# Altium schematic sheet 06) ANALOG TRANSLATION.SchDoc
size 701 x 447 mm
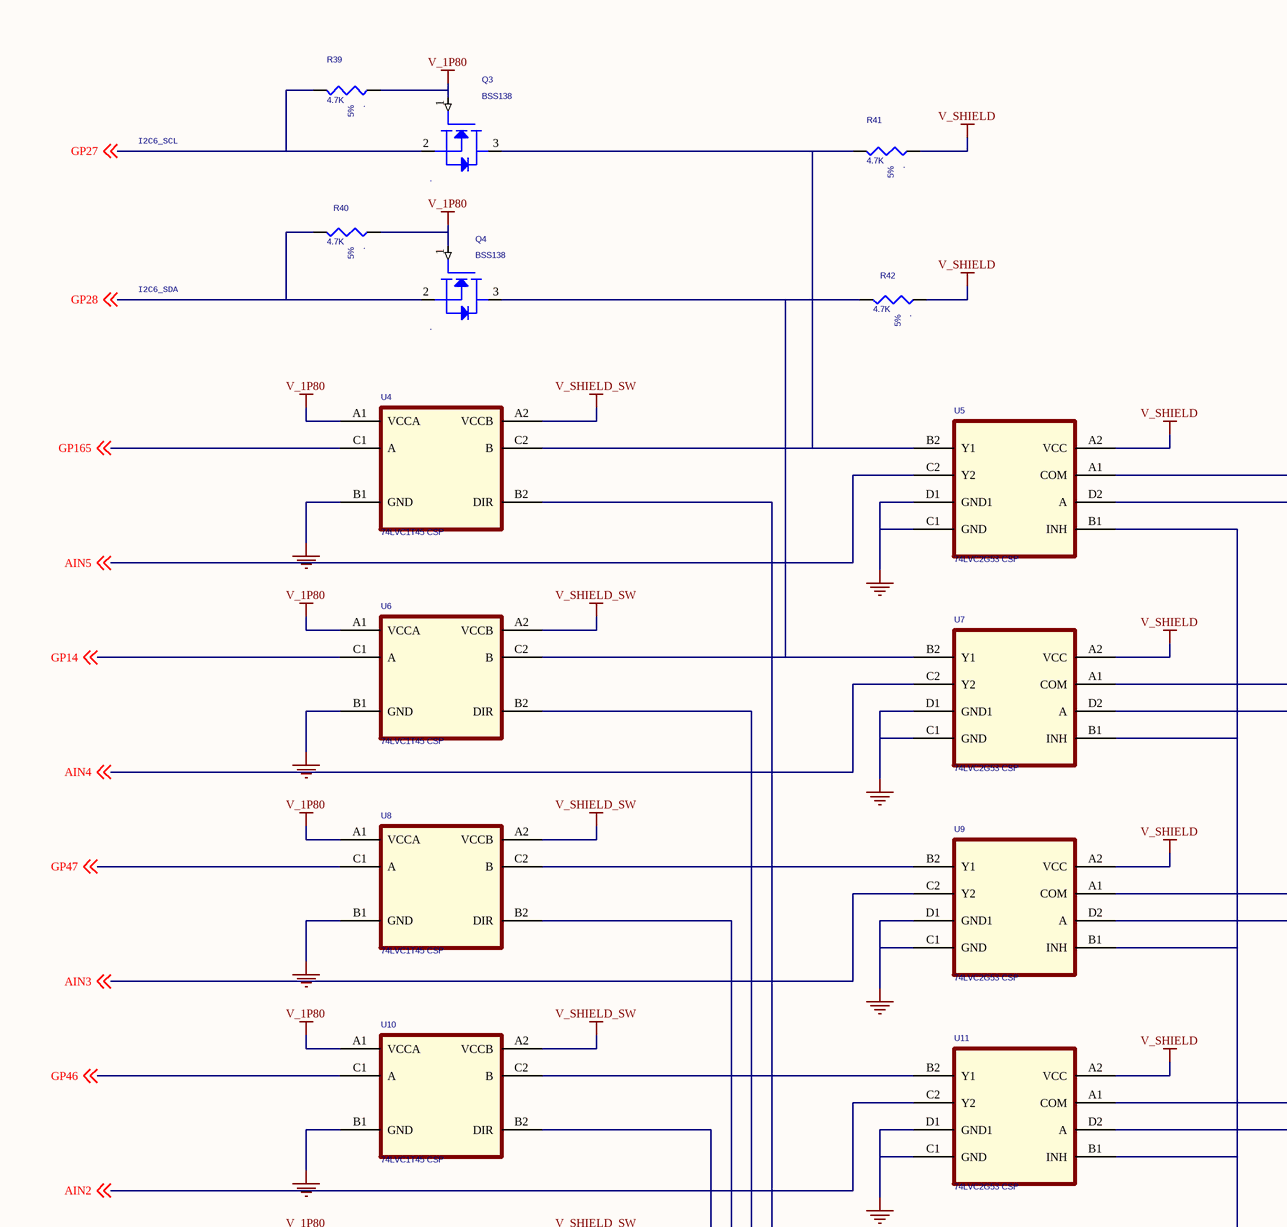
[diagram p0: 06) ANALOG TRANSLATION.SchDoc, top left]
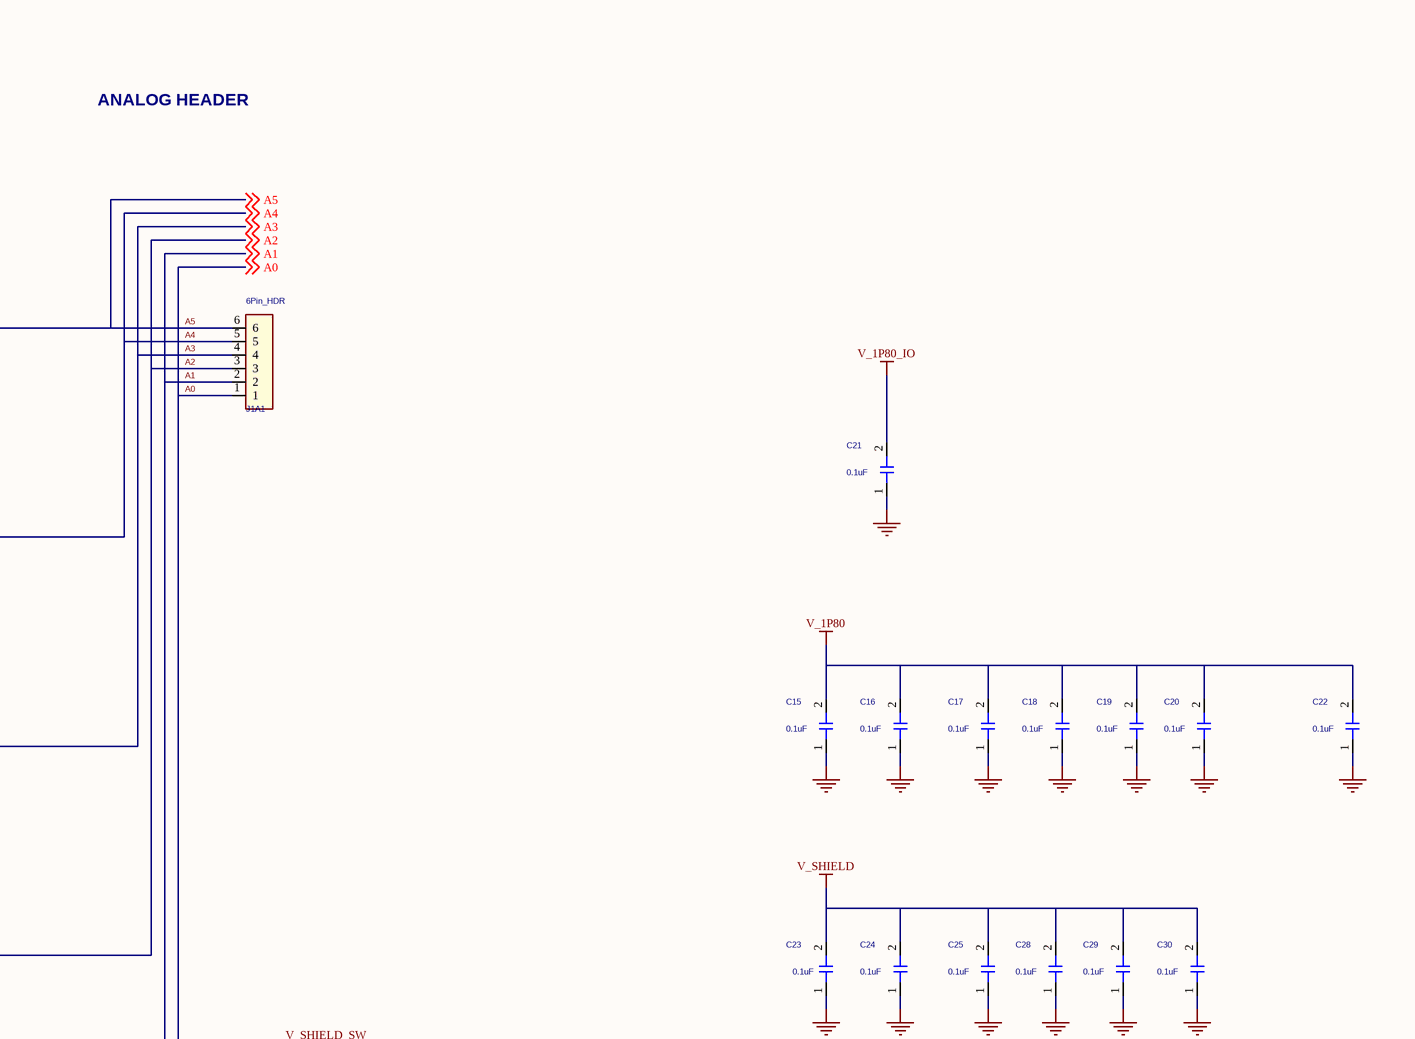
[diagram p1: 06) ANALOG TRANSLATION.SchDoc, top right]
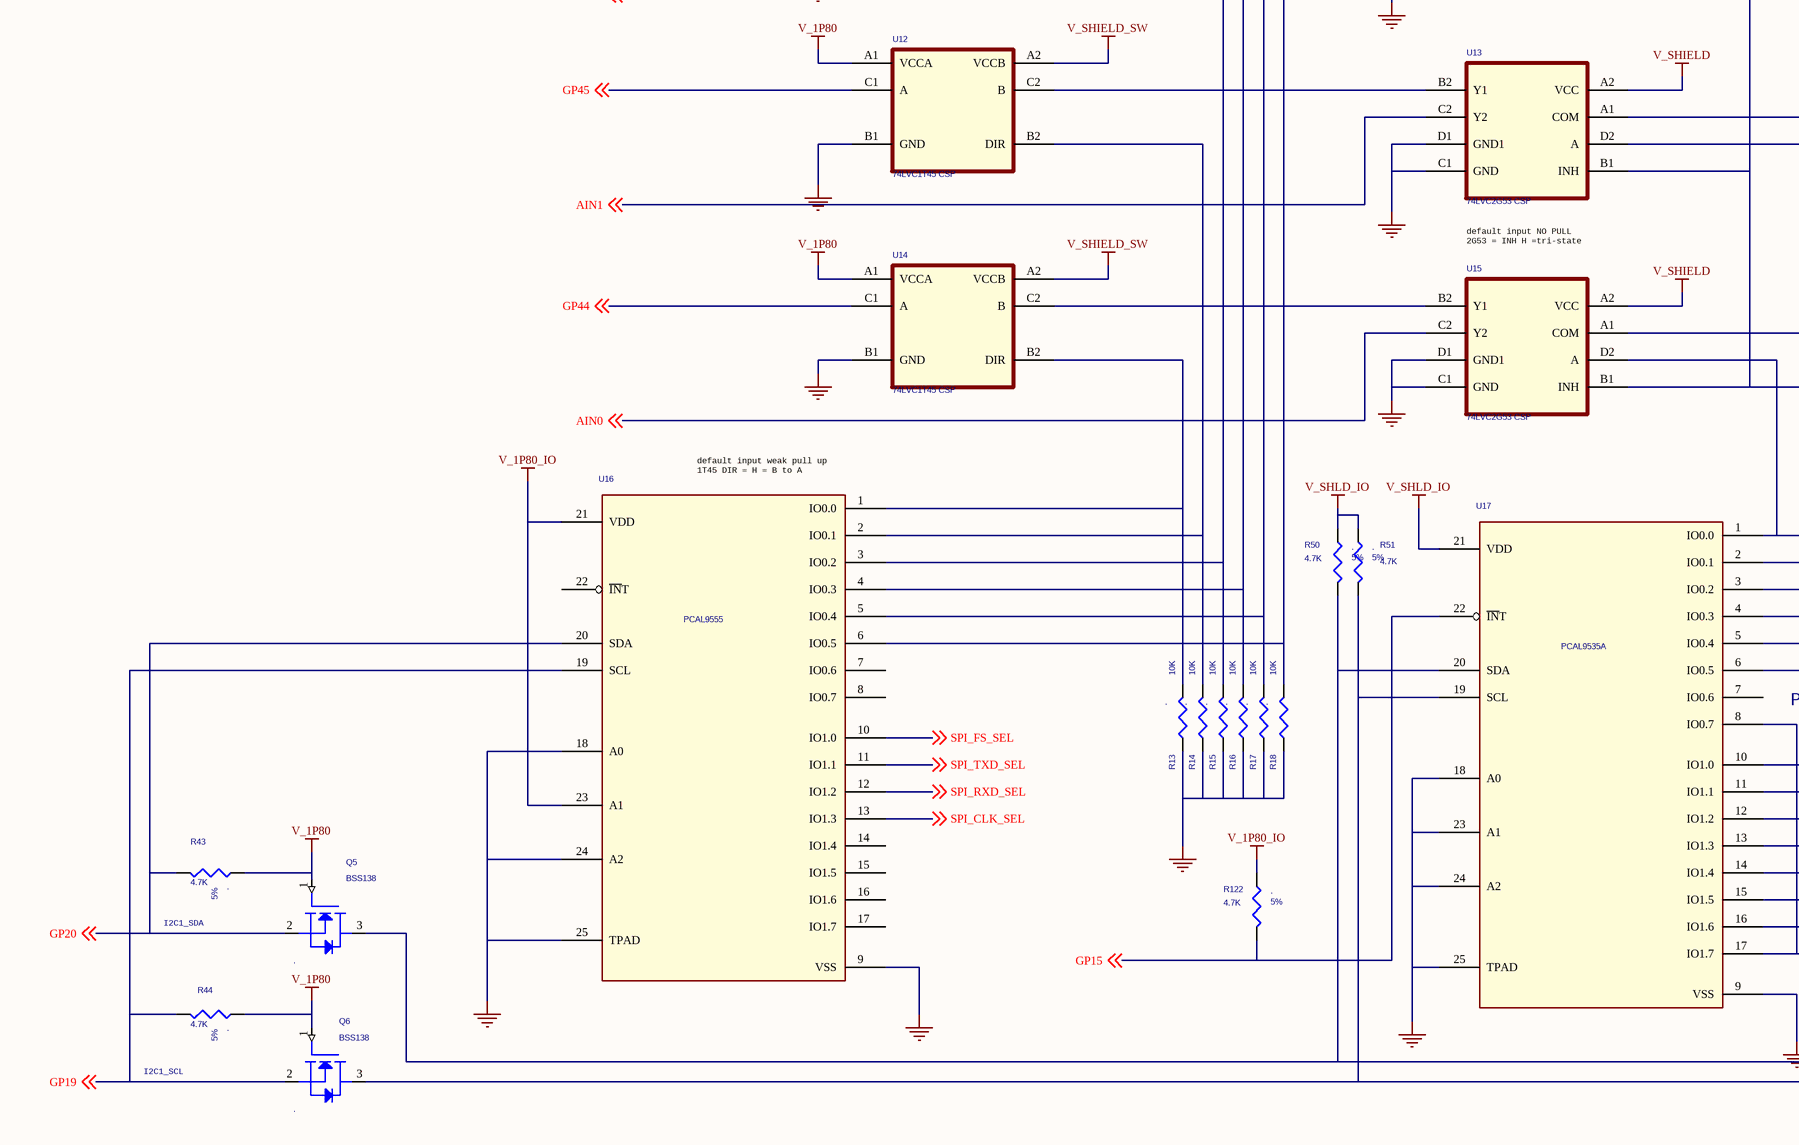
[diagram p2: 06) ANALOG TRANSLATION.SchDoc, bottom left]
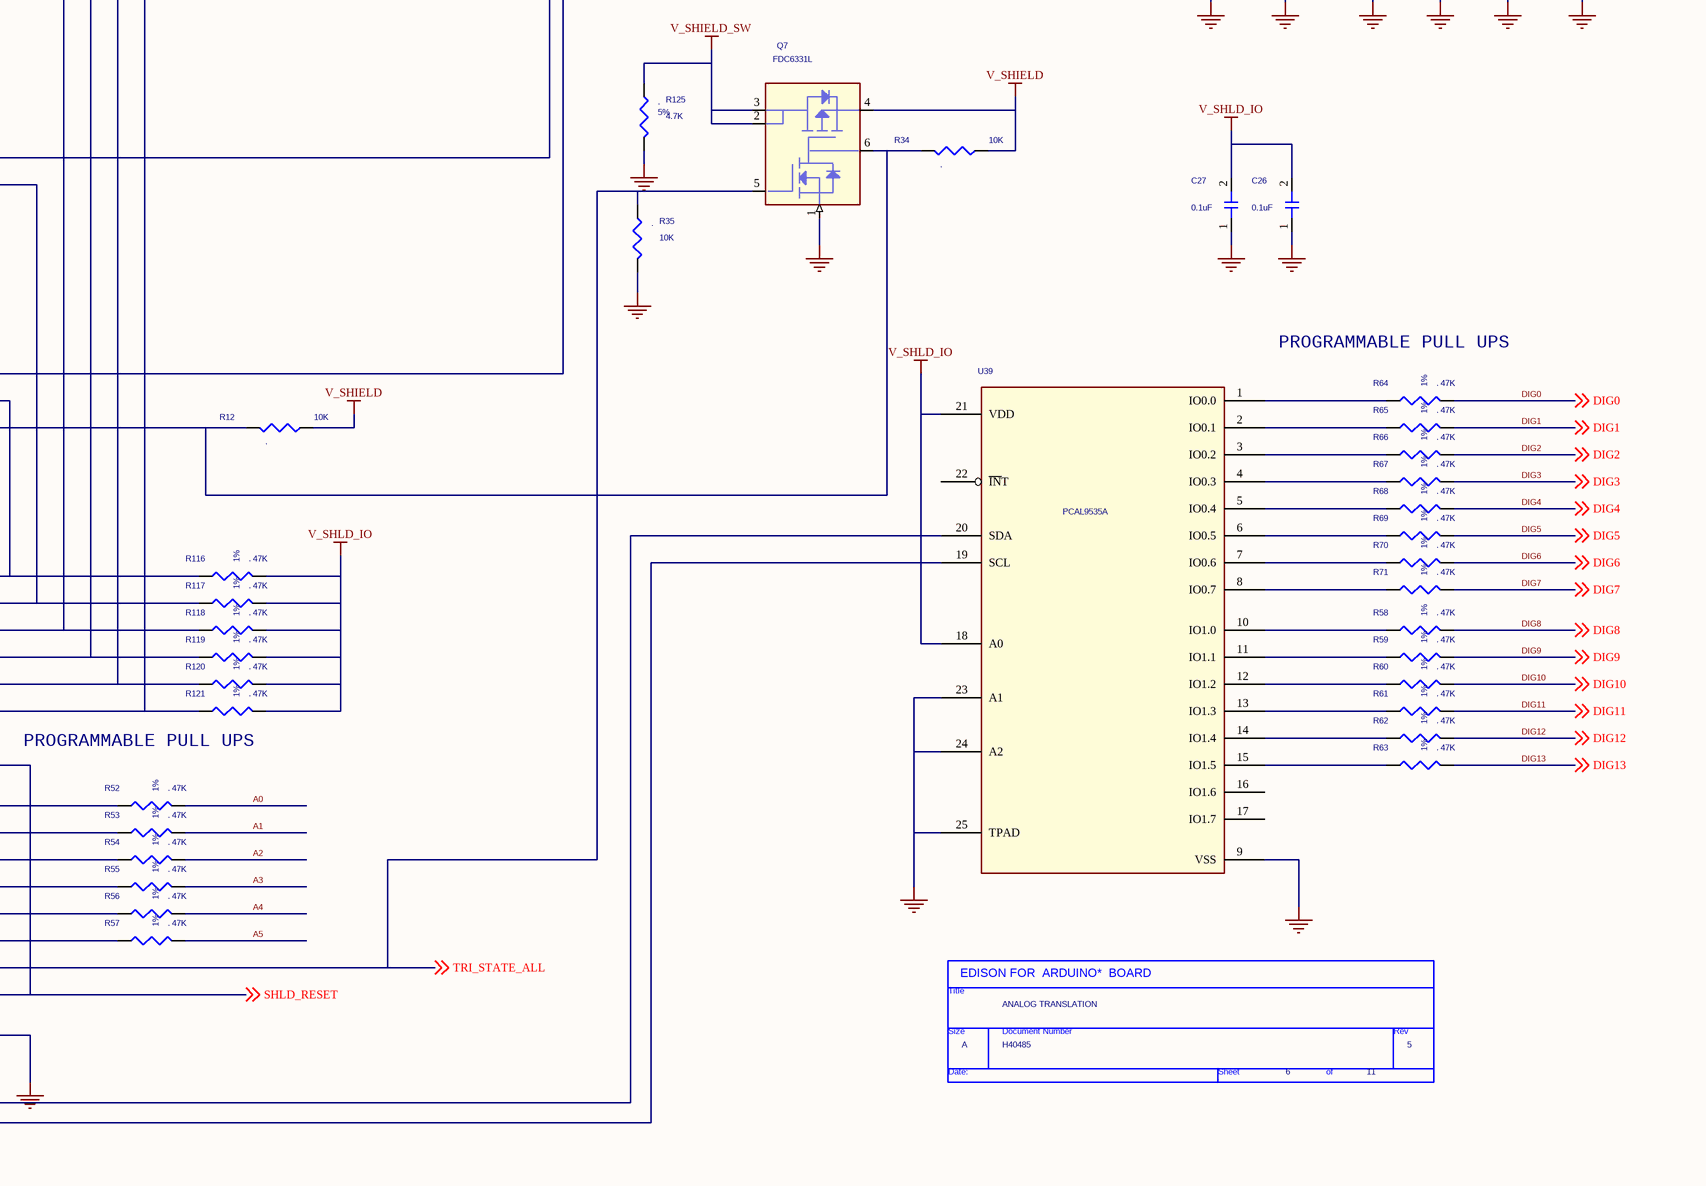
[diagram p3: 06) ANALOG TRANSLATION.SchDoc, bottom right]

## Parts
*  Page Count: 11  Page Number: 6  Page Size: A  Title: ANALOG TRANSLATION  RevCode: 5  Doc: H40485  (hidden comment: TitleBlock0)  (graphical)
C15  0.1uF  [C0201]
C16  0.1uF  [C0201]
C17  0.1uF  [C0201]
C18  0.1uF  [C0201]
C19  0.1uF  [C0201]
C20  0.1uF  [C0201]
C21  0.1uF  [C0201]
C22  0.1uF  [C0201]
C23  0.1uF  [C0201]
C24  0.1uF  [C0201]
C25  0.1uF  [C0201]
C26  0.1uF  [C0201]
C27  0.1uF  [C0201]
C28  0.1uF  [C0201]
C29  0.1uF  [C0201]
C30  0.1uF  [C0201]
J1A1  6Pin_HDR  [109728-038]
Q3  BSS138  NO_STUFF: .  [SOT23]
Q4  BSS138  NO_STUFF: .  [SOT23]
Q5  BSS138  NO_STUFF: .  [SOT23]
Q6  BSS138  NO_STUFF: .  [SOT23]
Q7  FDC6331L  [SSOT-6]
R12  10K  NO_STUFF: .  [SMR0201]
R13  10K  NO_STUFF: .  [SMR0201]
R14  10K  NO_STUFF: .  [SMR0201]
R15  10K  NO_STUFF: .  [SMR0201]
R16  10K  NO_STUFF: .  [SMR0201]
R17  10K  NO_STUFF: .  [SMR0201]
R18  10K  NO_STUFF: .  [SMR0201]
R34  10K  NO_STUFF: .  [SMR0201]
R35  10K  NO_STUFF: .  [SMR0201]
R39  4.7K  NO_STUFF: .  TOL: 5%  [SMR0201]
R40  4.7K  NO_STUFF: .  TOL: 5%  [SMR0201]
R41  4.7K  NO_STUFF: .  TOL: 5%  [SMR0201]
R42  4.7K  NO_STUFF: .  TOL: 5%  [SMR0201]
R43  4.7K  NO_STUFF: .  TOL: 5%  [SMR0201]
R44  4.7K  NO_STUFF: .  TOL: 5%  [SMR0201]
R50  4.7K  NO_STUFF: .  TOL: 5%  [SMR0201]
R51  4.7K  NO_STUFF: .  TOL: 5%  [SMR0201]
R52  47K  TOL: 1%  NO_STUFF: .  [SMR0201]
R53  47K  TOL: 1%  NO_STUFF: .  [SMR0201]
R54  47K  TOL: 1%  NO_STUFF: .  [SMR0201]
R55  47K  TOL: 1%  NO_STUFF: .  [SMR0201]
R56  47K  TOL: 1%  NO_STUFF: .  [SMR0201]
R57  47K  TOL: 1%  NO_STUFF: .  [SMR0201]
R58  47K  TOL: 1%  NO_STUFF: .  [SMR0201]
R59  47K  TOL: 1%  NO_STUFF: .  [SMR0201]
R60  47K  TOL: 1%  NO_STUFF: .  [SMR0201]
R61  47K  TOL: 1%  NO_STUFF: .  [SMR0201]
R62  47K  TOL: 1%  NO_STUFF: .  [SMR0201]
R63  47K  TOL: 1%  NO_STUFF: .  [SMR0201]
R64  47K  TOL: 1%  NO_STUFF: .  [SMR0201]
R65  47K  TOL: 1%  NO_STUFF: .  [SMR0201]
R66  47K  TOL: 1%  NO_STUFF: .  [SMR0201]
R67  47K  TOL: 1%  NO_STUFF: .  [SMR0201]
R68  47K  TOL: 1%  NO_STUFF: .  [SMR0201]
R69  47K  TOL: 1%  NO_STUFF: .  [SMR0201]
R70  47K  TOL: 1%  NO_STUFF: .  [SMR0201]
R71  47K  TOL: 1%  NO_STUFF: .  [SMR0201]
R116  47K  TOL: 1%  NO_STUFF: .  [SMR0201]
R117  47K  TOL: 1%  NO_STUFF: .  [SMR0201]
R118  47K  TOL: 1%  NO_STUFF: .  [SMR0201]
R119  47K  TOL: 1%  NO_STUFF: .  [SMR0201]
R120  47K  TOL: 1%  NO_STUFF: .  [SMR0201]
R121  47K  TOL: 1%  NO_STUFF: .  [SMR0201]
R122  4.7K  NO_STUFF: .  TOL: 5%  [SMR0201]
R125  4.7K  NO_STUFF: .  TOL: 5%  [SMR0201]
U4  74LVC1T45 CSP  [bga6_5mm_37x57]
U5  74LVC2G53 CSP  [bga8_2X4_P5MM]
U6  74LVC1T45 CSP  [bga6_5mm_37x57]
U7  74LVC2G53 CSP  [bga8_2X4_P5MM]
U8  74LVC1T45 CSP  [bga6_5mm_37x57]
U9  74LVC2G53 CSP  [bga8_2X4_P5MM]
U10  74LVC1T45 CSP  [bga6_5mm_37x57]
U11  74LVC2G53 CSP  [bga8_2X4_P5MM]
U12  74LVC1T45 CSP  [bga6_5mm_37x57]
U13  74LVC2G53 CSP  [bga8_2X4_P5MM]
U14  74LVC1T45 CSP  [bga6_5mm_37x57]
U15  74LVC2G53 CSP  [bga8_2X4_P5MM]
U16  PCAL9555  [LCC25_S41_5DF89X89MA]
U17  PCAL9535A  [LCC25_S41_5DF89X89MA]
U39  PCAL9535A  [LCC25_S41_5DF89X89MA]

## Nets
GND: C15.1(END1) C16.1(END1) C17.1(END1) C18.1(END1) C19.1(END1) C20.1(END1) C21.1(END1) C22.1(END1) C23.1(END1) C24.1(END1) C25.1(END1) C26.1(END1) C27.1(END1) C28.1(END1) C29.1(END1) C30.1(END1) Q7.1(R2) R13.1 R14.1 R15.1 R16.1 R17.1 R18.1 R35.1 R125.1 U4.B1(GND) U5.C1(GND) U5.D1(GND1) U6.B1(GND) U7.C1(GND) U7.D1(GND1) U8.B1(GND) U9.C1(GND) U9.D1(GND1) U10.B1(GND) U11.C1(GND) U11.D1(GND1) U12.B1(GND) U13.C1(GND) U13.D1(GND1) U14.B1(GND) U15.C1(GND) U15.D1(GND1) U16.9(VSS) U16.18(A0) U16.24(A2) U16.25(TPAD) U17.9(VSS) U17.18(A0) U17.23(A1) U17.24(A2) U17.25(TPAD) U39.9(VSS) U39.23(A1) U39.24(A2) U39.25(TPAD)
V_1P80: C15.2(END2) C16.2(END2) C17.2(END2) C18.2(END2) C19.2(END2) C20.2(END2) C22.2(END2) Q3.1(G) Q4.1(G) Q5.1(G) Q6.1(G) R39.2 R40.2 R43.2 R44.2 U4.A1(VCCA) U6.A1(VCCA) U8.A1(VCCA) U10.A1(VCCA) U12.A1(VCCA) U14.A1(VCCA)
V_1P80_IO: C21.2(END2) R122.2 U16.21(VDD) U16.23(A1)
V_SHIELD: C23.2(END2) C24.2(END2) C25.2(END2) C28.2(END2) C29.2(END2) C30.2(END2) Q7.4(VOUT) R12.1 R34.1 R41.2 R42.2 U5.A2(VCC) U7.A2(VCC) U9.A2(VCC) U11.A2(VCC) U13.A2(VCC) U15.A2(VCC)
V_SHIELD_SW: Q7.2(VOUT2) Q7.3(VOUT1) R125.2 U4.A2(VCCB) U6.A2(VCCB) U8.A2(VCCB) U10.A2(VCCB) U12.A2(VCCB) U14.A2(VCCB)
V_SHLD_IO: C26.2(END2) C27.2(END2) R50.2 R51.2 R116.2 R117.2 R118.2 R119.2 R120.2 R121.2 U17.21(VDD) U39.18(A0) U39.21(VDD)
A0: J1A1.1 R52.2 U15.A1(COM) ; off-sheet A0
A1: J1A1.2 R53.2 U13.A1(COM) ; off-sheet A1
A2: J1A1.3 R54.2 U11.A1(COM) ; off-sheet A2
A3: J1A1.4 R55.2 U9.A1(COM) ; off-sheet A3
A4: J1A1.5 R56.2 U7.A1(COM) ; off-sheet A4
A5: J1A1.6 R57.2 U5.A1(COM) ; off-sheet A5
AIN0: U15.C2(Y2) ; off-sheet AIN0
AIN1: U13.C2(Y2) ; off-sheet AIN1
AIN2: U11.C2(Y2) ; off-sheet AIN2
AIN3: U9.C2(Y2) ; off-sheet AIN3
AIN4: U7.C2(Y2) ; off-sheet AIN4
AIN5: U5.C2(Y2) ; off-sheet AIN5
DIG0: R64.2 ; off-sheet DIG0
DIG1: R65.2 ; off-sheet DIG1
DIG2: R66.2 ; off-sheet DIG2
DIG3: R67.2 ; off-sheet DIG3
DIG4: R68.2 ; off-sheet DIG4
DIG5: R69.2 ; off-sheet DIG5
DIG6: R70.2 ; off-sheet DIG6
DIG7: R71.2 ; off-sheet DIG7
DIG8: R58.2 ; off-sheet DIG8
DIG9: R59.2 ; off-sheet DIG9
DIG10: R60.2 ; off-sheet DIG10
DIG11: R61.2 ; off-sheet DIG11
DIG12: R62.2 ; off-sheet DIG12
DIG13: R63.2 ; off-sheet DIG13
GP14: U6.C1(A) ; off-sheet GP14
GP15: R122.1 U17.22(~{IN}T) ; off-sheet GP15
GP19: Q6.2(S) R44.1 U16.19(SCL) ; off-sheet GP19
GP20: Q5.2(S) R43.1 U16.20(SDA) ; off-sheet GP20
GP27: Q3.2(S) R39.1 ; off-sheet GP27
GP28: Q4.2(S) R40.1 ; off-sheet GP28
GP44: U14.C1(A) ; off-sheet GP44
GP45: U12.C1(A) ; off-sheet GP45
GP46: U10.C1(A) ; off-sheet GP46
GP47: U8.C1(A) ; off-sheet GP47
GP165: U4.C1(A) ; off-sheet GP165
SHLD_RESET: U17.8(IO0.7) U17.17(IO1.7) ; off-sheet SHLD_RESET
SPI_CLK_SEL: U16.13(IO1.3) ; off-sheet SPI_CLK_SEL
SPI_FS_SEL: U16.10(IO1.0) ; off-sheet SPI_FS_SEL
SPI_RXD_SEL: U16.12(IO1.2) ; off-sheet SPI_RXD_SEL
SPI_TXD_SEL: U16.11(IO1.1) ; off-sheet SPI_TXD_SEL
TRI_STATE_ALL: Q7.5(ON) R35.2 U17.16(IO1.6) ; off-sheet TRI_STATE_ALL
NetQ3_3: Q3.3(D) R41.1 U4.C2(B) U5.B2(Y1)
NetQ4_3: Q4.3(D) R42.1 U6.C2(B) U7.B2(Y1)
NetQ5_3: Q5.3(D) R50.1 U17.20(SDA) U39.20(SDA)
NetQ6_3: Q6.3(D) R51.1 U17.19(SCL) U39.19(SCL)
NetQ7_6: Q7.6(R1C1) R12.2 R34.2 U5.B1(INH) U7.B1(INH) U9.B1(INH) U11.B1(INH) U13.B1(INH) U15.B1(INH)
NetR13_2: R13.2 U14.B2(DIR) U16.1(IO0.0)
NetR14_2: R14.2 U12.B2(DIR) U16.2(IO0.1)
NetR15_2: R15.2 U10.B2(DIR) U16.3(IO0.2)
NetR16_2: R16.2 U8.B2(DIR) U16.4(IO0.3)
NetR17_2: R17.2 U6.B2(DIR) U16.5(IO0.4)
NetR18_2: R18.2 U4.B2(DIR) U16.6(IO0.5)
NetR52_1: R52.1 U17.10(IO1.0)
NetR53_1: R53.1 U17.11(IO1.1)
NetR54_1: R54.1 U17.12(IO1.2)
NetR55_1: R55.1 U17.13(IO1.3)
NetR56_1: R56.1 U17.14(IO1.4)
NetR57_1: R57.1 U17.15(IO1.5)
NetR58_1: R58.1 U39.10(IO1.0)
NetR59_1: R59.1 U39.11(IO1.1)
NetR60_1: R60.1 U39.12(IO1.2)
NetR61_1: R61.1 U39.13(IO1.3)
NetR62_1: R62.1 U39.14(IO1.4)
NetR63_1: R63.1 U39.15(IO1.5)
NetR64_1: R64.1 U39.1(IO0.0)
NetR65_1: R65.1 U39.2(IO0.1)
NetR66_1: R66.1 U39.3(IO0.2)
NetR67_1: R67.1 U39.4(IO0.3)
NetR68_1: R68.1 U39.5(IO0.4)
NetR69_1: R69.1 U39.6(IO0.5)
NetR70_1: R70.1 U39.7(IO0.6)
NetR71_1: R71.1 U39.8(IO0.7)
NetR116_1: R116.1 U15.D2(A) U17.1(IO0.0)
NetR117_1: R117.1 U13.D2(A) U17.2(IO0.1)
NetR118_1: R118.1 U11.D2(A) U17.3(IO0.2)
NetR119_1: R119.1 U9.D2(A) U17.4(IO0.3)
NetR120_1: R120.1 U7.D2(A) U17.5(IO0.4)
NetR121_1: R121.1 U5.D2(A) U17.6(IO0.5)
NetU8_C2: U8.C2(B) U9.B2(Y1)
NetU10_C2: U10.C2(B) U11.B2(Y1)
NetU12_C2: U12.C2(B) U13.B2(Y1)
NetU14_C2: U14.C2(B) U15.B2(Y1)

Not connected (* = marked no-connect by the designer): U16 7(IO0.6) 8(IO0.7) 14(IO1.4) 15(IO1.5) 16(IO1.6) 17(IO1.7) 22(~{IN}T); U17 7(IO0.6); U39 16(IO1.6) 17(IO1.7) 22(~{IN}T)

## Notes on the sheet
- I2C6_SCL
- I2C6_SDA
- ANALOG HEADER
- default input NO PULL
  2G53 = INH H =tri-state
- PROGRAMMABLE PULL UPS
- (near U16) default input weak pull up
  1T45 DIR = H = B to A
- (near R121) PROGRAMMABLE PULL UPS
- (near R43) I2C1_SDA
- I2C1_SCL
- (in symbol TitleBlock0) EDISON FOR  ARDUINO*  BOARD; Title; Size; Document Number; Rev; Date:; Sheet; of

## Library data of the parts
C15-C22 C24-C27 = CAP: CAPC,X5R,0201,0.1UF,10.00V,+/- 10%; PART_NUMBER: C83410-014; Manufacturer: GENERIC; OriginalSymbolOrigin: (-50,50); Process: SMD; Code: 27; VOLTAGE: ?; PERC: ?; PATH: ?
C23 C28-C30 = CAP: CAPC,X5R,0201,0.1UF,10.00V,+/- 10%; Manufacturer: GENERIC; PART_NUMBER: C83410-014; OriginalSymbolOrigin: (-50,50); Code: 27; Process: SMD; VOLTAGE: ?; PERC: ?; PATH: ?
J1A1 = CON6,HDR,TH,0.1in,C77962-001: CONN,PLUG,VERT,1X6,2.54MM,THM,90147_1106; NO_STUFF: .; RATING: 1Amax; DEVICE: H46111-001; LEAD_FREE: YES; BOM: x; ROOM: NO_ROOM; IPN: H46111-001; PART_NUMBER: H46111-001; FINANCE: x
Q3-Q6 = XSTR,BSS138,FET,NCH,SOT23: IC,DS,FET N,SOT-23,BSS138LT3G; FINANCE: x; LEAD_FREE: YES; Device: C81974-001; BOM: x; IPN: C81974-001; PART_NUMBER: C81974-001
Q7 = IC,FDC6331,LOADSWI: C,FDC6331L,LOAD_SWITCH,2.8A; PART_NUMBER: G79283-001; NO_STUFF: .; LEAD_FREE: YES; BOM: x; IPN: G79283-001; Device: fdc6331; FINANCE: x; PART NUMBER: G79283-001
R12-R18 R34 R35 = RESD,0201,5%,1/20W,10K: RES D,0201,10.00 kOHM,5.00%,1/20W,YES; Device: C80792-002; TOL: 5%; BOM: x; ROOM: AUDIO_CODEC; RATING: 1/20W; IPN: C80792-002; PART_NUMBER: C80792-002; LEAD_FREE: YES; FINANCE: x
R39-R44 R50 R51 R122 R125 = RESD,0201,5%,1/20W,4.7K: RES D,0201,4.70 kOHM,5.00%,1/20W,YES; Device: C80792-014; BOM: x; ROOM: APE_PMIC_MISC; RATING: 1/20W; IPN: C80792-014; PART_NUMBER: C80792-014; LEAD_FREE: YES; FINANCE: x
R52-R71 R116-R121 = RESD,0201,1%,1/20W,47K: RES_D,0201,47.0kOHM,1.00%,1/20W,; PART_NUMBER: C48657-118; FINANCE: x; LEAD_FREE: YES; BOM: x; IPN: C48657-118; RATING: 1/20W; Device: C48657-118
U4 U6 U8 U10 U12 U14 = IC,74LVC1T45,LOG,BGA6,TRNSSVR: IC,LOG,TRANSCEIVE,CSP,SN74LVC1T45,NI3S,; FINANCE: x; LEAD_FREE: YES; IPN: G42189-001; NO_STUFF: .; MFG: TI; MFG P/N: 74LVC1T45YZPR; BOM: x; DEVICE: G42189-001; PART_NUMBER: G42189-001
U5 U7 U9 U11 U13 U15 = IC,74LVC2G53: IC,LOG,MULTIPLEX,uBGA,742G53,NI,; PART_NUMBER: H40914-001; FINANCE: x; LEAD_FREE: YES; IPN: NEED; NO_STUFF: .; MFG: TI; BOM: x; DEVICE: LVC2G53; MFG P/N: 74LVC2G53
U16 = IC,PCAL9555,16bit_GPIO: IC,LIN,INTFC,QFN,PCAL9555,GPIO,; NO_STUFF: .; DEVICE: H31921-001; LEAD_FREE: YES; BOM: x; IPN: H31921-001; Part_Number: H31921-001; FINANCE: x; PART NUMBER: H31921-001
U17 U39 = IC,PCAL9535a,16bit_GPIO: Part_Number: H47895-001; FINANCE: x; LEAD_FREE: YES; NO_STUFF: .; BOM: x; IPN: h47895-001; DEVICE: H47895-001
* = TitleBlock0: Page Create Date: March  8, 1995